# Altium schematic sheet powersupply.SchDoc
size A3; SheetNumber: 3; SheetTotal: 3
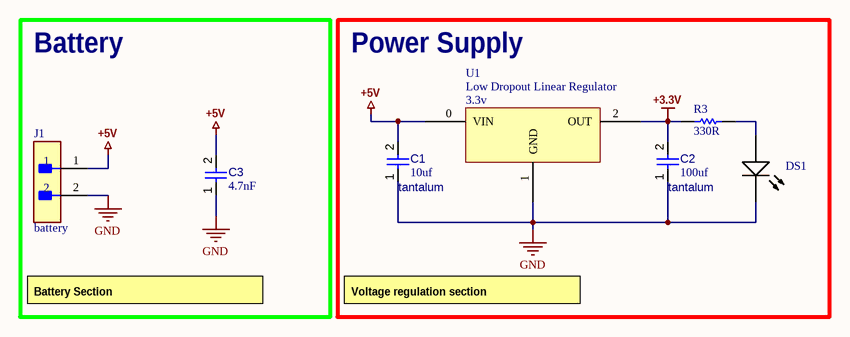
[diagram p0: powersupply.SchDoc]

## Parts
C1  tantalum  value 10uf  [CAPC0603(1608)100_L]
C2  tantalum  value 100uf  [CAPC0603(1608)100_L]
C3  value 4.7nF  [CAPC0603(1608)100_L]  (hidden comment: Capacitor 4.7µF +/-20% 10V 0603)
DS1  16-219A/T2D-AR2T1QY/3T  [EVRL-0402-2_V]  (value not drawn)
J1  battery  [FP-TMM-102-03-T-S-MFG]
R3  value 330R  [RESC1608X55X25ML10T15]  (hidden comment: Resistor 0R +/- 5% 0603 100 mW)
U1  Low Dropout Linear Regulator  Output Volatge: 3.3v  [4 pin SOT]

## Blocks framed on the sheet
Battery: C3 J1
Power Supply: C1 C2 DS1 R3 U1

## Nets
+3.3V: C2.2 R3.1 U1.2(OUT)
+5V: C1.2 C3.2 J1.1 U1.0(VIN)
GND: C1.1 C2.1 C3.1 DS1.2(K) J1.2 U1.1(GND)
NetDS1_1: DS1.1(A) R3.2

## Notes on the sheet
- Battery Section
- Voltage regulation section

## Library data of the parts
C1-C3 = CMP-001-00076-4: Chip Capacitor, 4.7µF +/-20%, 10V, 0603, Thickness 1 mm; Tolerance: 10%; Mounting Technology: SMT; Case/Package: 0603; Pins: 2; Min Operating Temperature: -55°C; Max Operating Temperature: 85°C; Voltage Rating: 10V
DS1 = CMP-007-00000-2: Chip LED, White, 5 V, 10 mA, 30 mW, -40 to 85 degC, 2-Pin SMD (0402), RoHS, Tape and Reel; Manufacturer: Everlight Electronics; Luminous Intensity: 360mcd; Forward Voltage: 2.6V; Viewing Angle: 130degrees; Power: 30mW; Forward Current: 5mA; Package Quantity: 3000; Max Operating Temperature: 85°C; Datasheet Version: Rev. 5, 04/2013; Datasheet URL: http://www.everlight.com/file/ProductFile/16-219A-T2D-AR2T1QY-3T.pdf; Package Reference: 0402; Mounting Technology: SM; Case/Package: 0402; Illumination Colour: White; Manufacturer URL: http://www.everlight.com/; Package Description: 2-Pin Surface Mount Device, Body 1 x 0.5 mm; RoHS Compliant: True; Packaging: TapeandReel; Min Operating Temperature: -40°C
J1 = CMP-02766-001621-1: CONN HEADER VERT 2POS 2MM; Max Voltage Rating (AC): 500V; Gender: Male; Number of Positions: 2; Max Current Rating: 3.9A; Series: TMM; Contact Plating: Tin; Depth: 1.97mm; Connector Type: Header; Housing Material: Polymer; Contact Shape: Square; Contact Finish - Mating: TIN; Package Quantity: 1; Length: 4mm; Radiation Hardening: No; RoHS Compliant: Yes; Min Operating Temperature: -55°C; Max Operating Temperature: 105°C; Contact Material: Bronze; Lead Free: Lead Free; Color: Black; Termination: Solder; Number of Rows: 1; Contact Type: Male Pin; Contact Mating Length: 0.157inch; Insulation Material: Polymer; Number of Contacts: 2; Pitch: 2mm; Housing Color: Black; Insulation Color: Black; Orientation: Straight; REACH SVHC: No SVHC; Fastening Type: Pull; Packaging: Bulk; Mount: Through Hole
R3 = CMP-009-00006-5: Chip Resistor, 0 Ohm, 0.1 W, -55 to 155 degC, 0603 (1608 Metric); Power: 100mW; Voltage Rating: 50V; Max Operating Temperature: 155°C; RoHS Compliant: True; Mounting Technology: SM; Case/Package: 0603; Min Operating Temperature: -55°C; Tolerance: 5%; Pins: 2
U1 = lm1117: ComponentLink1Description: Datasheet; ComponentLink1URL: https://www.ti.com/lit/ds/symlink/lm1117.pdf